# Altium schematic sheet Copy of min_system.SchDoc
size A4; SheetNumber: 1; SheetTotal: 1; SPICEModelCacheKHOQBMBG: <root>  <DocumentId>KHOQBMBG</DocumentId>  <CacheFrame Number="0">    <Model Name="xtal" Kind="CKT">      <Text>*Generic type:crystal pkg:HC33/51.SUBCKT XTAL 1 2 PARAMS: FREQ=1Meg RS=750 C=13pf Q=1000LX 1 3 {((Q*RS)/(6.2831852*FREQ))} IC=0.5MCX 3 4 {(1/(Q*6.2831852*FREQ*RS))}C0 1 2 {C}RS 4 2 {RS}.ENDS XTAL</Text>    </Model>    <Model Name="cap" Kind="MDL">      <Text>*Default semiconductor capacitor.MODEL CAP C()</Text>    </Model>    <Model Name="led0" Kind="MDL">      <Text>*Typ INFRARED GaAs LED: Vf=1.2V Vr=5V If=40mA trr=3uS*LED Pinout: 1=A, 2=K.MODEL LED0 D (IS=93.5P RS=84M N=2.63 BV=5 IBV=10U+ CJO=2.97P VJ=.75 M=.333 TT=4.32U)</Text>    </Model>  </CacheFrame></root>
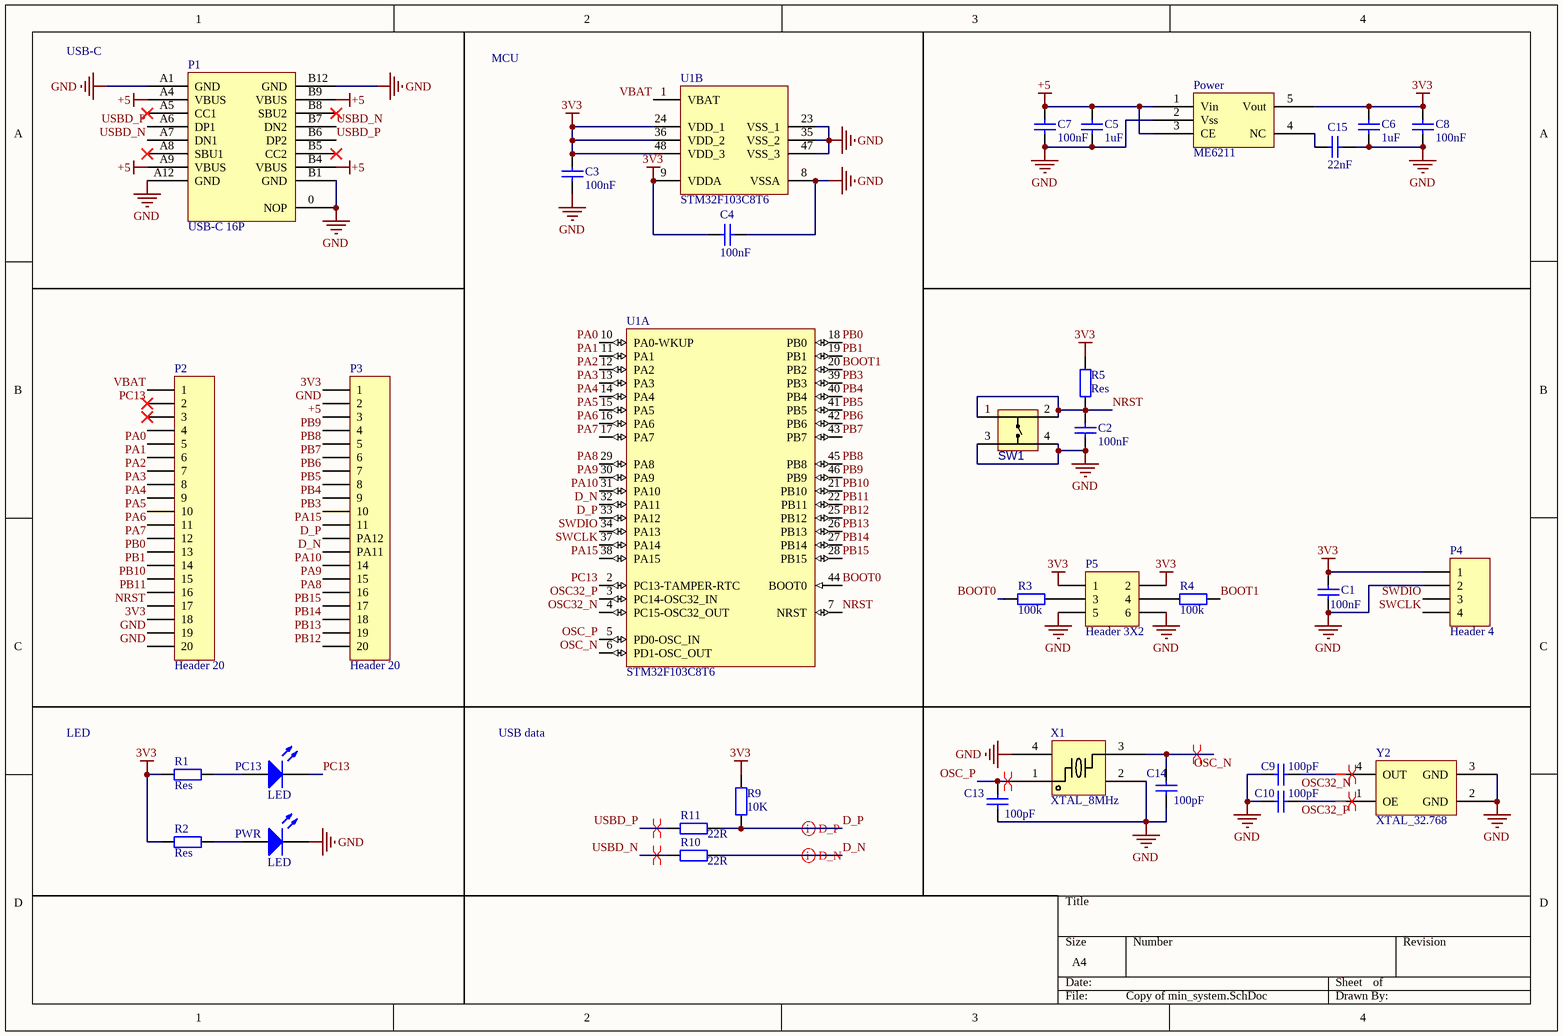
[diagram p0: Copy of min_system.SchDoc]

## Parts
C1  100nF  [1608[0603]]
C2  100nF  [1608[0603]]
C3  100nF  [1608[0603]]
C4  100nF  [1608[0603]]
C5  1uF  [6-0805_M]
C6  1uF  [6-0805_M]
C7  100nF  [1608[0603]]
C8  100nF  [1608[0603]]
C9  value 100pF  [1608[0603]]  (hidden comment: Cap)
C10  value 100pF  [1608[0603]]  (hidden comment: Cap)
C13  value 100pF  [1608[0603]]  (hidden comment: Cap)
C14  value 100pF  [1608[0603]]  (hidden comment: Cap)
C15  22nF  [1608[0603]]
P1  USB-C 16P  [USB-C 16P]
P2  Header 20  [HDR1X20]
P3  Header 20  [HDR1X20]
P4  Header 4  [HDR1X4]
P5  Header 3X2  [HDR2X3]
PC13  LED  [LED_0603]
Power  ME6211  [ME6211]
PWR  LED  [LED_0603]
R1  Res  [1608[0603]]
R2  Res  [1608[0603]]
R3  100k  [1608[0603]]
R4  100k  [1608[0603]]
R5  Res  [1608[0603]]
R9  10K  [1608[0603]]
R10  22R  [1608[0603]]
R11  22R  [1608[0603]]
SW1  TS-1089S-AR02516  [Button-SMD_4P]  (value not drawn)
U1  STM32F103C8T6  [STM-LQFP48_N]  (parts A,B of 2)
X1  XTAL_8MHz  [XTAL_3225]
Y2  XTAL_32.768  [MC-306]

## Nets
3V3: C1.2 C3.2 C4.2 C6.2 C8.2 P2.18 P3.1 P4.1 P5.1 P5.2 Power.5(Vout) R1.1 R2.1 R5.2 R9.1 U1.9(VDDA) U1.24(VDD_1) U1.36(VDD_2) U1.48(VDD_3)
+5: C5.2 C7.2 P1.A4(VBUS) P1.A9(VBUS) P1.B4(VBUS) P1.B9(VBUS) P3.3 Power.1(Vin) Power.3(CE)
GND: C1.1 C2.1 C3.1 C4.1 C5.1 C6.1 C7.1 C8.1 C9.2 C10.1 C13.2 C14.1 C15.2 P1.0(NOP) P1.A1(GND) P1.A12(GND) P1.B1(GND) P1.B12(GND) P2.19 P2.20 P3.2 P4.2 P5.5 P5.6 Power.2(Vss) PWR.2(K) SW1.3 SW1.4 U1.8(VSSA) U1.23(VSS_1) U1.35(VSS_2) U1.47(VSS_3) X1.2 X1.4 Y2.2(GND) Y2.3(GND)
BOOT0: R3.1 U1.44(BOOT0)
BOOT1: R4.2 U1.20(PB2)
D_N: P3.13(PA11) R10.2 U1.32(PA11)
D_P: P3.12(PA12) R9.2 R11.2 U1.33(PA12)
NRST: C2.2 P2.17 R5.1 SW1.1 SW1.2 U1.7(NRST)
OSC32_N: C9.1 U1.4(PC15-OSC32_OUT) Y2.4(OUT)
OSC32_P: C10.2 U1.3(PC14-OSC32_IN) Y2.1(OE)
OSC_N: C14.2 U1.6(PD1-OSC_OUT) X1.3
OSC_P: C13.1 U1.5(PD0-OSC_IN) X1.1
PA0: P2.5 U1.10(PA0-WKUP)
PA1: P2.6 U1.11(PA1)
PA2: P2.7 U1.12(PA2)
PA3: P2.8 U1.13(PA3)
PA4: P2.9 U1.14(PA4)
PA5: P2.10 U1.15(PA5)
PA6: P2.11 U1.16(PA6)
PA7: P2.12 U1.17(PA7)
PA8: P3.16 U1.29(PA8)
PA9: P3.15 U1.30(PA9)
PA10: P3.14 U1.31(PA10)
PA15: P3.11 U1.38(PA15)
PB0: P2.13 U1.18(PB0)
PB1: P2.14 U1.19(PB1)
PB3: P3.10 U1.39(PB3)
PB4: P3.9 U1.40(PB4)
PB5: P3.8 U1.41(PB5)
PB6: P3.7 U1.42(PB6)
PB7: P3.6 U1.43(PB7)
PB8: P3.5 U1.45(PB8)
PB9: P3.4 U1.46(PB9)
PB10: P2.15 U1.21(PB10)
PB11: P2.16 U1.22(PB11)
PB12: P3.20 U1.25(PB12)
PB13: P3.19 U1.26(PB13)
PB14: P3.18 U1.27(PB14)
PB15: P3.17 U1.28(PB15)
PC13: P2.2 PC13.2(K) U1.2(PC13-TAMPER-RTC)
SWCLK: P4.4 U1.37(PA14)
SWDIO: P4.3 U1.34(PA13)
USBD_N: P1.A7(DN1) P1.B7(DN2) R10.1
USBD_P: P1.A6(DP1) P1.B6(DP2) R11.1
VBAT: P2.1 U1.1(VBAT)
NetC15_1: C15.1 Power.4(NC)
NetP5_3: P5.3 R3.2
NetP5_4: P5.4 R4.1
NetPC13_1: PC13.1(A) R1.2
NetPWR_1: PWR.1(A) R2.2

Not connected (* = marked no-connect by the designer): P1 A5(CC1)* A8(SBU1)* B5(CC2)* B8(SBU2)*; P2 3* 4

## Layout directives
differential pair: D_N, D_P, OSC32_N, OSC32_P, OSC_N, OSC_P, USBD_N, USBD_P

## Notes on the sheet
- USB-C
- MCU
- LED
- USB data

## Library data of the parts
C1-C8 C15 = Cap: Capacitor; Value: 100pF; Published: 8-Jun-2000; LatestRevisionDate: 17-Jul-2002; LatestRevisionNote: Re-released for DXP Platform.; PackageReference: RAD-0.3; Publisher: Altium Limited; PackageDescription: Radial Cap, Thru-Hole; 2 Leads; 0.3 in Pin Spacing
C9 C10 C13 C14 = Cap: Capacitor; Published: 8-Jun-2000; LatestRevisionDate: 17-Jul-2002; LatestRevisionNote: Re-released for DXP Platform.; PackageReference: RAD-0.3; Publisher: Altium Limited; PackageDescription: Radial Cap, Thru-Hole; 2 Leads; 0.3 in Pin Spacing
P2 P3 = Header 20: Header, 20-Pin; LatestRevisionDate: 17-Jul-2002; LatestRevisionNote: Re-released for DXP Platform.; Publisher: Altium Limited
P4 = Header 4: Header, 4-Pin; LatestRevisionDate: 17-Jul-2002; LatestRevisionNote: Re-released for DXP Platform.; Publisher: Altium Limited
P5 = Header 3X2: Header, 3-Pin, Dual row; LatestRevisionDate: 17-Jul-2002; LatestRevisionNote: Re-released for DXP Platform.; Publisher: Altium Limited
PC13 PWR = LED: Typical INFRARED GaAs LED; Published: 8-Jun-2000; LatestRevisionDate: 08-Jul-2005; LatestRevisionNote: Mech Layer 1 removed.; PackageReference: LED-0; Publisher: Altium Limited; PackageDescription: LED; 2 Leads
Power = ME6211: SOT23-5
R1-R5 R9-R11 = Res: Resistor; Published: 8-Jun-2000; LatestRevisionDate: 17-Jul-2002; LatestRevisionNote: Re-released for DXP Platform.; PackageReference: AXIAL-0.4; Publisher: Altium Limited; PackageDescription: Axial Device, Thru-Hole; 2 Leads; 0.4 in Pin Spacing
SW1 = Button-SMD_4P: SMD_4P-L4.2-W3.3-P2.15-LS5.1; Manufacturer: XUNPU(讯普); Add into BOM: yes; Contact Current: 50mA; Voltage Rating (DC): 12V; Insulation Resistance: 100MΩ; Circuit: 单刀单掷; Actuator Style: 椭圆形按钮; Actuator/Cap Color: 白色; Operating Force: 160gf@±50gf; Mechanical Life: 100000; Pin Style: SMD接片; Switch Length: 4.2mm; Switch Width: 3.25mm; Switch Height: 2.5mm; Strike Gundam: 否; Name: TS-1089S-AR02516; Symbol: TS-1089S-AR02516; Device: TS-1089S-AR02516; LCSC Part Name: 3×4×2.5 160gf 轻触开关; Supplier Part: C720479; Manufacturer Part: TS-1089S-AR02516; Supplier Footprint: SMD; JLCPCB Part Class: Extended Part; Datasheet: https://atta.szlcsc.com/upload/public/pdf/source/20200810/C720479_389650BB8B865DD3822BD59B78D6CF64.pdf; Supplier: LCSC; Convert to PCB: yes; Mounting Style: 立贴; Operating Temperature: -30℃~+80℃
U1 = STM32F103C8T6: ARM Cortex-M3 32-bit MCU, 64 KB Flash, 20 KB Internal RAM, 37 I/Os, 48-pin LQFP, -40 to 85 degC, Tray; A/D Converter: 2x12-bit (10 Channel); FLASH Size (Prog) (kB): 64; I/Os (High Current): 37; Internal RAM Size (kB): 20; Operating Frequency(F) (Processor speed) (MHz): 72; Supply Voltage(Vcc) min (V): 2; DatasheetVersion: Rev. 16; PackageVersion: Rev. 6, 06/2013; PackageReference: LQFP48; PackageDescription: 48-Pin Low Profile Quad Flat Package, 7 x 7 mm Body, 0.5 mm Pitch; Supplier 1: Digi-Key; Supplier Part Number 1: 497-6063-ND; Supplier 2: Farnell; Supplier Part Number 2: 1447637; Supplier 3: Newark; Supplier Part Number 3: 59M2182; Supplier 4: Newark; Supplier Part Number 4: 57P1222; Supplier 5: Mouser; Supplier Part Number 5: 511-STM32F103C8T6; Core: ARM Cortex-M3; Packing: Tray; Mounting Technology: Surface Mount; PartNumber: STM32F103C8T6; ComponentLink1Description: Manufacturer URL; ComponentLink1URL: http://www.st.com/web/en/home.html; ComponentLink2Description: Datasheet; ComponentLink2URL: http://www.st.com/st-web-ui/static/active/en/resource/technical/document/datasheet/CD00161566.pdf; ComponentLink3Description: Package Specification; ComponentLink3URL: http://www.st.com/st-web-ui/static/active/en/resource/technical/document/datasheet/DM00058181.pdf
X1 = XTAL_3225
Y2 = XTAL_32.768: 32.768kHz; Published: 8-Jun-2000; LatestRevisionDate: 17-Jul-2002; LatestRevisionNote: Re-released for DXP Platform.; PackageReference: R38; Publisher: Altium Limited; PackageDescription: Crystal, Thru-Hole; 2 Leads; Body 3.1 x 8.2 mm (Dia.xH)